# EAGLE schematic drive_monofasico_ir21844 versão 7.xx (EAGLE 7.7.0)
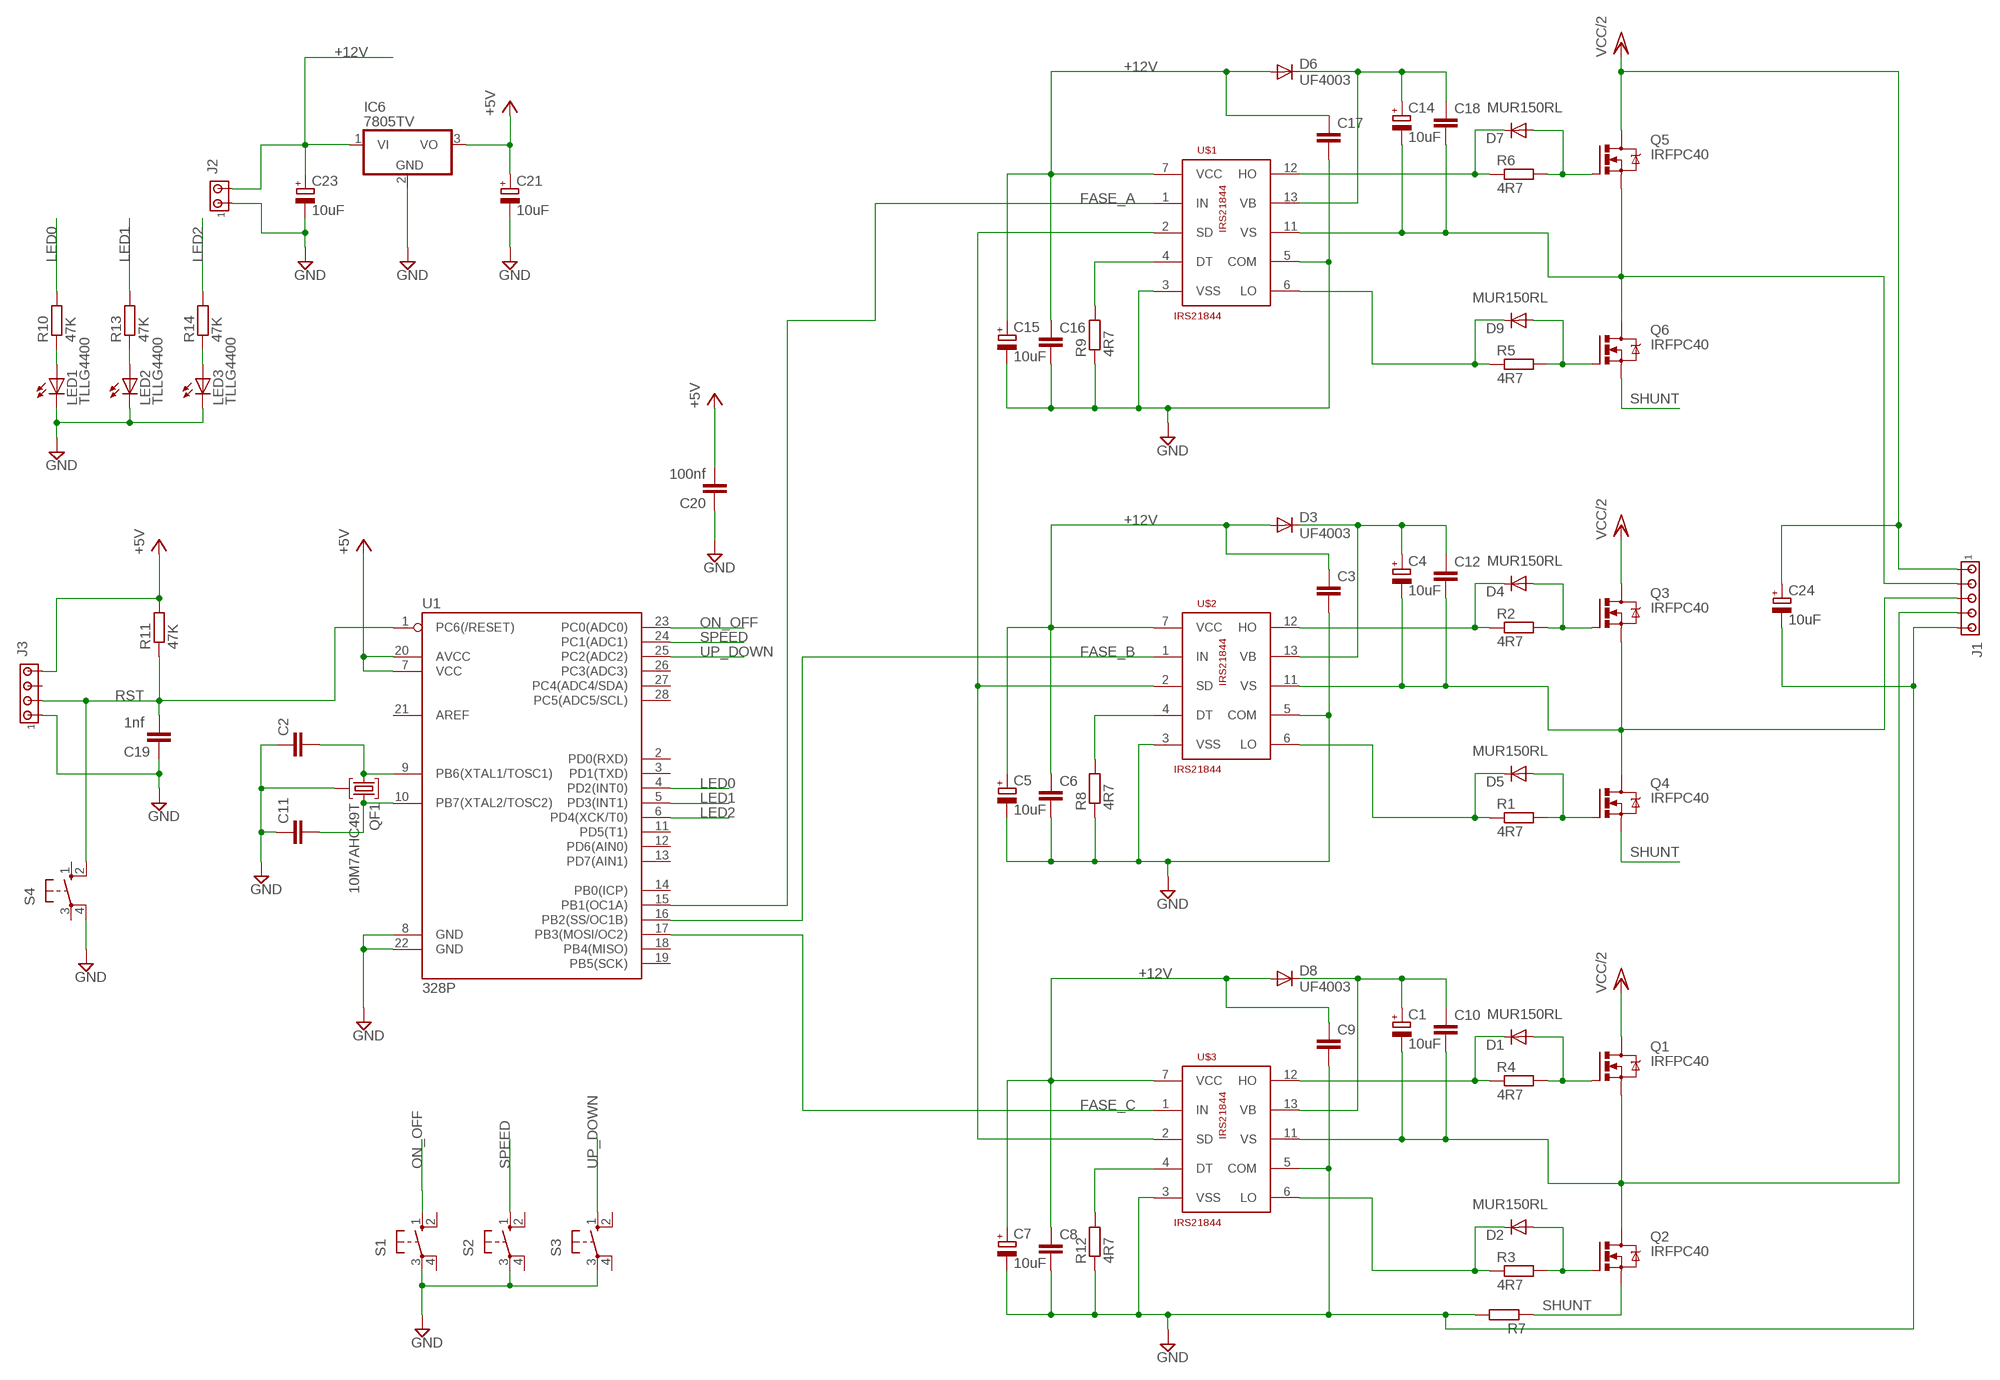
[diagram p0: schematic, sheet 1]

## Parts
C1  10uF  CPOL-EUE5-6  [E5-6]
C2  C7.5/3  [C7.5B3]
C3  C7.5/3  [C7.5B3]
C4  10uF  CPOL-EUE5-6  [E5-6]
C5  10uF  CPOL-EUE5-6  [E5-6]
C6  C7.5/3  [C7.5B3]
C7  10uF  CPOL-EUE5-6  [E5-6]
C8  C7.5/3  [C7.5B3]
C9  C7.5/3  [C7.5B3]
C10  C7.5/3  [C7.5B3]
C11  C7.5/3  [C7.5B3]
C12  C7.5/3  [C7.5B3]
C14  10uF  CPOL-EUE5-6  [E5-6]
C15  10uF  CPOL-EUE5-6  [E5-6]
C16  C7.5/3  [C7.5B3]
C17  C7.5/3  [C7.5B3]
C18  C7.5/3  [C7.5B3]
C19  1nf  C-EU050-025X075  [C050-025X075]
C20  100nf  C-EU050-025X075  [C050-025X075]
C21  10uF  CPOL-EUE5-6  [E5-6]
C23  10uF  CPOL-EUE5-6  [E5-6]
C24  10uF  CPOL-EUE5-6  [E5-6]
D1  MUR150RL  [DO41-10]
D2  MUR150RL  [DO41-10]
D3  UF4003  [DO41-10]
D4  MUR150RL  [DO41-10]
D5  MUR150RL  [DO41-10]
D6  UF4003  [DO41-10]
D7  MUR150RL  [DO41-10]
D8  UF4003  [DO41-10]
D9  MUR150RL  [DO41-10]
IC6  7805TV  [TO220V]
J1  MTA05-156  [1X5MTA]
J2  MTA02-100  [10X02MTA]
J3  MTA04-100  [10X04MTA]
LED1  TLLG4400  [LED3MM]
LED2  TLLG4400  [LED3MM]
LED3  TLLG4400  [LED3MM]
Q1  IRFPC40  [TO247BV]
Q2  IRFPC40  [TO247BV]
Q3  IRFPC40  [TO247BV]
Q4  IRFPC40  [TO247BV]
Q5  IRFPC40  [TO247BV]
Q6  IRFPC40  [TO247BV]
QF1  10M7AHC49T  [HC49U]
R1  4R7  R-EU_0207/12  [0207/12]
R2  4R7  R-EU_0207/12  [0207/12]
R3  4R7  R-EU_0207/12  [0207/12]
R4  4R7  R-EU_0207/12  [0207/12]
R5  4R7  R-EU_0207/12  [0207/12]
R6  4R7  R-EU_0207/12  [0207/12]
R7  R-EU_0613/15  [P0613/15]
R8  4R7  R-EU_0207/12  [0207/12]
R9  4R7  R-EU_0207/12  [0207/12]
R10  47K  R-EU_0207/12  [0207/12]
R11  47K  R-EU_0207/12  [0207/12]
R12  4R7  R-EU_0207/12  [0207/12]
R13  47K  R-EU_0207/12  [0207/12]
R14  47K  R-EU_0207/12  [0207/12]
S1  10-XX  [B3F-10XX]
S2  10-XX  [B3F-10XX]
S3  10-XX  [B3F-10XX]
S4  10-XX  [B3F-10XX]
U1  328P  ATMEGA328P_PDIP  [DIP28]
U$1  IRS21844  [IRS21844]
U$2  IRS21844  [IRS21844]
U$3  IRS21844  [IRS21844]

## Nets
+12V: C3.1 C5.+ C6.1 C7.+ C8.1 C9.1 C15.+ C16.1 C17.1 C23.+ D3.A D6.A D8.A IC6.1(VI) J2.2 U$1.7(VCC) U$2.7(VCC) U$3.7(VCC)
+VCC: C20.2 C21.+ IC6.3(VO) J3.4 R11.2 U1.7(VCC) U1.20(AVCC) ; supply symbol labelled +5V
FASE_A: U1.15(PB1(OC1A)) U$1.1(IN)
FASE_B: U1.16(PB2(SS/OC1B)) U$2.1(IN)
FASE_C: U1.17(PB3(MOSI/OC2)) U$3.1(IN)
GND: C2.1 C3.2 C5.- C6.2 C7.- C8.2 C9.2 C11.1 C15.- C16.2 C17.2 C19.2 C20.1 C21.- C23.- C24.- IC6.2(GND) J1.5 J2.1 J3.1 LED1.K(C) LED2.K(C) LED3.K(C) QF1.2 R7.2 R8.1 R9.1 R12.1 S1.3(P) S2.3(P) S3.3(P) S4.4(P1) U1.8(GND) U1.22(GND) U$1.3(VSS) U$1.5(COM) U$2.3(VSS) U$2.5(COM) U$3.3(VSS) U$3.5(COM)
LED0: R10.2 U1.4(PD2(INT0))
LED1: R13.2 U1.5(PD3(INT1))
LED2: R14.2 U1.6(PD4(XCK/T0))
N$1: U$1.2(SD) U$2.2(SD) U$3.2(SD)
N$2: D1.A Q1.G R4.2
N$3: D1.C R4.1 U$3.12(HO)
N$4: D2.C R3.1 U$3.6(LO)
N$5: D4.A Q3.G R2.2
N$6: R9.2 U$1.4(DT)
N$7: D5.A Q4.G R1.2
N$8: D4.C R2.1 U$2.12(HO)
N$9: D5.C R1.1 U$2.6(LO)
N$10: C2.2 QF1.1 U1.9(PB6(XTAL1/TOSC1))
N$11: C11.2 QF1.3 U1.10(PB7(XTAL2/TOSC2))
N$12: D2.A Q2.G R3.2
N$13: LED1.A R10.1
N$14: LED2.A R13.1
N$15: D7.A Q5.G R6.2
N$16: D9.A Q6.G R5.2
N$17: D7.C R6.1 U$1.12(HO)
N$18: D9.C R5.1 U$1.6(LO)
N$19: LED3.A R14.1
N$21: C14.+ C18.1 D6.C U$1.13(VB)
N$22: C14.- C18.2 J1.2 Q5.S Q6.D U$1.11(VS)
N$23: R8.2 U$2.4(DT)
N$24: C4.- C12.2 J1.3 Q3.S Q4.D U$2.11(VS)
N$25: C4.+ C12.1 D3.C U$2.13(VB)
N$30: C1.- C10.2 J1.4 Q1.S Q2.D U$3.11(VS)
N$31: C1.+ C10.1 D8.C U$3.13(VB)
N$34: R12.2 U$3.4(DT)
ON_OFF: S1.1(S) U1.23(PC0(ADC0))
RST: C19.1 J3.2 R11.1 S4.2(S1) U1.1(PC6(/RESET))
SHUNT: Q2.S Q4.S Q6.S R7.1
SPEED: S2.1(S) U1.24(PC1(ADC1))
UP_DOWN: S3.1(S) U1.25(PC2(ADC2))
VCC/2: C24.+ J1.1 Q1.D Q3.D Q5.D
Unconnected: J3.3 S1.2(S1) S1.4(P1) S2.2(S1) S2.4(P1) S3.2(S1) S3.4(P1) S4.1(S) S4.3(P) U1.2(PD0(RXD)) U1.3(PD1(TXD)) U1.11(PD5(T1)) U1.12(PD6(AIN0)) U1.13(PD7(AIN1)) U1.14(PB0(ICP)) U1.18(PB4(MISO)) U1.19(PB5(SCK)) U1.21(AREF) U1.26(PC3(ADC3)) U1.27(PC4(ADC4/SDA)) U1.28(PC5(ADC5/SCL))

## Library data of the parts
C1 C4 C5 C7 C14 C15 C21 C23 C24 = rcl:CPOL-EU: POLARIZED CAPACITOR, European symbol
C2 C3 C6 C8-C12 C16-C18 = capacitor-wima:C: CAPACITOR naming: grid - package width
C19 C20 = resistor:C-EU: CAPACITOR, European symbol
D1 D2 D4 D5 D7 D9 = diode-2:MUR150RL: DIODE
D3 D6 D8 = diode-2:UF4003: DIODE ultrafast recovery diode, 200 V rectifier
IC6 = linear:78*: Positive VOLTAGE REGULATOR Source: http://cache.national.com/ds/LM/LM78L05.pdf http://www.fairchildsemi.com/ds/LM/LM7805.pdf
J1 = con-amp:MTA05-156: AMP connector
J2 = con-amp:MTA02-100: AMP connector
J3 = con-amp:MTA04-100: AMP connector
LED1-LED3 = led:TLLG4400: Low Current (2mA) LED 3 mm Tinted Diffused Package color GREEN Source: Data sheet <http://www.farnell.com/datasheets/391098.pdf>; MF: VISHAY SEMICONDUCTOR; OC_FARNELL: 1612435
Q1-Q6 = transistor-power:IRFPC40: N-CHANNEL MOS FET
QF1 = crystal:10M*A: Monolithic Crystal Filters Source: www.vanlong.com; OC_FARNELL: unknown; OC_NEWARK: unknown
R1-R6 R8 R9 R12 = rcl:R-EU_: RESISTOR, European symbol
R7 R10 R11 R13 R14 = resistor:R-EU_: RESISTOR, European symbol
S1-S4 = switch-omron:10-XX: OMRON SWITCH; MPN: B3F-1000; OC_FARNELL: 176432; OC_NEWARK: 36M3542
U1 = ecc:ATMEGA328P_PDIP: Atmel 328P Through hole ATMEGA328P uC used in the Arduino 32kb flash, 1k EEPROM, 2k SRAM Datasheet <http://www.sparkfun.com/datasheets/Components/SMD/ATMega328.pdf> SparkFun Products Storefront component: AVR 28 Pin 20MHz 32K 6A/D - ATMega328P <https://www.sparkfun.com/products/9061> (COM-09061) SparkFun Simon Says - Through-Hole Soldering Kit <https://www.sparkfun.com/products/10547> (KIT-10547) SparkFun Learn to Solder - Simon Says <https://www.sparkfun.com/products/13708> (KIT-13708) SparkFun BigTime Watch Kit <https://www.sparkfun.com/products/11734> (KIT-11734) SparkFun ClockIt <https://www.sparkfun.com/products/10930> (KIT-10930) SparkFun Serial Enabled LCD Kit <https://www.sparkfun.com/products/10097> (LCD-10097) SparkFun Simon Tilts - Through Hole Soldering Kit <https://www.sparkfun.com/products/12634> (KIT-12634) SparkFun Frequency Counter Kit <https://www.sparkfun.com/products/10140> (KIT-10140) FabFM Radio Kit <https://www.sparkfun.com/products/11043> (KIT-11043) SparkFun Binary Blaster Kit <https://www.sparkfun.com/products/12037> (KIT-12037) SparkFun Metro-Gnome <https://www.sparkfun.com/products/9236> (KIT-09236) ATmega328 with Arduino Optiboot (Uno) <https://www.sparkfun.com/products/10524> (DEV-10524); PROD_ID: IC-09136
U$1-U$3 = Projeto_MSP01:IRS21844: DRIVER MOSFET